# Altium schematic sheet LT8316.SchDoc: LT8316 Respin
size A4; Author: Alfonso Faria Espinoza; CompanyName: Waterloop; DrawnBy: Alfonso; Organization: Waterloop; Address1: Engineering 5; DocumentNumber: 1; Revision: 1; SheetNumber: 1; SheetTotal: 1
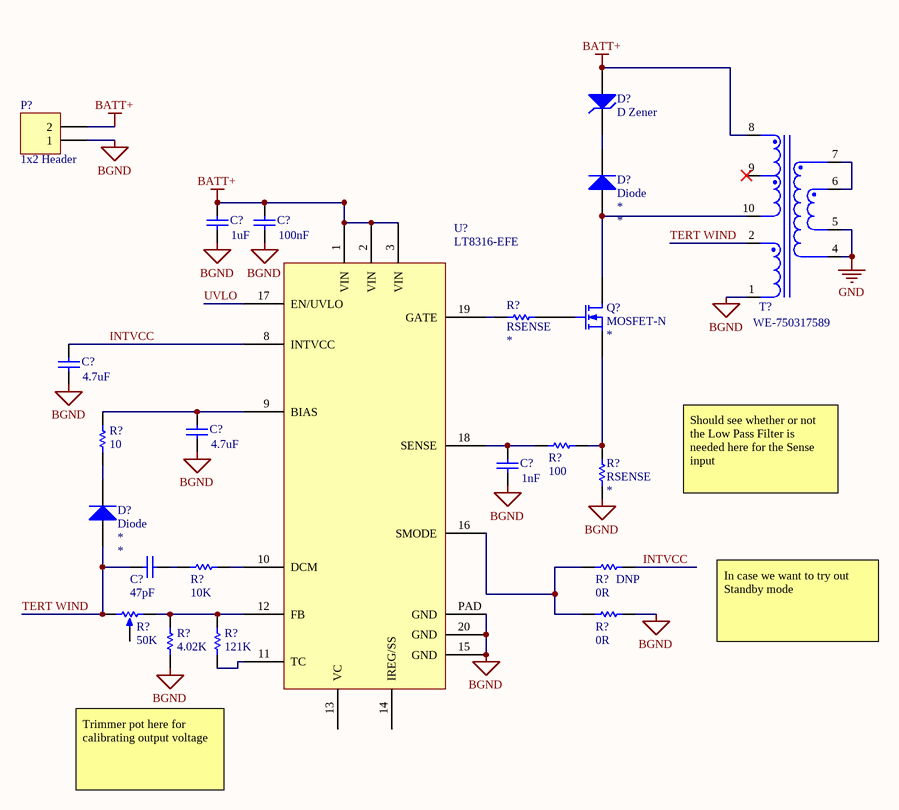
[diagram p0: LT8316.SchDoc]

## Parts
(Parts that share a designator on the sheet are numbered #1, #2 ... from top to bottom, then left to right.)
C?#1  value 1uF  (hidden comment: Capacitor - Nonpolarized)
C?#2  value 100nF  (hidden comment: Capacitor - Nonpolarized)
C?#3  value 4.7uF  (hidden comment: Capacitor - Nonpolarized)
C?#4  value 4.7uF  (hidden comment: Capacitor - Nonpolarized)
C?#5  value 1nF  (hidden comment: Capacitor - Nonpolarized)
C?#6  value 47pF  (hidden comment: Capacitor - Nonpolarized)
D?#1  D Zener  [DIODE-0.7]
D?#2  Diode
D?#3  Diode
P?  1x2 Header
Q?  MOSFET-N
R?#1  RSENSE  [0603 - Resistor]
R?#2  value 10  [0603 - Resistor]  (hidden comment: Resistor)
R?#3  value 100  [0603 - Resistor]  (hidden comment: RSENSE)
R?#4  RSENSE  [0603 - Resistor]
R?#5  value 10K  [0603 - Resistor]  (hidden comment: Resistor)
R?#6  DNP  value 0R  [0603 - Resistor]
R?#7  value 0R  [0603 - Resistor]  (hidden comment: Resistor)
R?#8  value 50K  (hidden comment: Resistor - Potentiometer)
R?#9  value 4.02K  [0603 - Resistor]  (hidden comment: Resistor)
R?#10  value 121K  [0603 - Resistor]  (hidden comment: Resistor)
T?  WE-750317589  [WE-750317589]
U?  LT8316-EFE  [LTC8315/8316]

## Nets
BATT+: C?#1.2 C?#2.2 D?#1.1(A) P?.2 T?.8 U?.1(VIN) U?.2(VIN) U?.3(VIN)
BGND: C?#1.1 C?#2.1 C?#3.1 C?#4.1 C?#5.1 P?.1 R?#4.1 R?#7.2 R?#9.1 T?.1 U?.15(GND) U?.20(GND) U?.PAD(GND)
GND: T?.4 T?.5
INTVCC: C?#3.2 R?#6.2 U?.8(INTVCC)
TERT WIND: C?#6.2 D?#3.1(A) R?#8.1(TOP) T?.2
UVLO: U?.17(EN/UVLO)
NetC?#4_2: C?#4.2 R?#2.2 U?.9(BIAS)
NetC?#5_2: C?#5.2 R?#3.2 U?.18(SENSE)
NetC?#6_1: C?#6.1 R?#5.1
NetD?#1_2: D?#1.2(K) D?#2.2(K)
NetD?#2_1: D?#2.1(A) Q?.1(D) T?.10
NetD?#3_2: D?#3.2(K) R?#2.1
NetQ?_2: Q?.2(G) R?#1.1
NetQ?_3: Q?.3(S) R?#3.1 R?#4.2
NetR?#1_2: R?#1.2 U?.19(GATE)
NetR?#5_2: R?#5.2 U?.10(DCM)
NetR?#6_1: R?#6.1 R?#7.1 U?.16(SMODE)
NetR?#8_2: R?#8.2(BOT) R?#9.2 R?#10.2 U?.12(FB)
NetR?#10_1: R?#10.1 U?.11(TC)
NetT?_6: T?.6 T?.7

Not connected (* = marked no-connect by the designer): R?#8 3(TAP); T? 9*; U? 13(VC) 14(IREG/SS)

## Notes on the sheet
- Should see whether or not the Low Pass Filter is needed here for the Sense input
- In case we want to try out Standby mode
- Trimmer pot here for calibrating output voltage
- Title:
- Size:
- Date:
- A4
- Author:
- Revision:
- Sheet
- of
- File:

## Library data of the parts
C?#1-C?#6 = Capacitor - Nonpolarized: Nonpolarized Capacitor; Supplier Part Number: *; Supplier: *; Manufacturer: *; Rating: *; Manufacturer Part Number: *
D?#1 = D Zener: Zener Diode; Published: 8-Jun-2000; LatestRevisionDate: 17-Jul-2002; LatestRevisionNote: Re-released for DXP Platform.; PackageReference: DIODE-0.7; Publisher: Altium Limited; PackageDescription: Diode, Thru-Hole; 2 Leads; 0.7 in Pin Spacing
P? = 1x2 Header: 1x2 Pin Header
Q? = MOSFET-N: N-Channel MOSFET; Supplier: *; Manufacturer Part Number: *; Supplier Part Number: *; Rating: *; Manufacturer: *; Value: *
R?#1 R?#3 R?#4 R?#6 = Resistor: Rating: *; Manufacturer Part Number: *; Manufacturer: *; Supplier Part Number: *; Supplier: *
  R?#1 R?#4: Value: *
R?#8 = Resistor - Potentiometer: Potentiometer; Manufacturer: *; Manufacturer Part Number: *; Supplier Part Number: *; Rating: *; Supplier: *
T? = WE-750317589: 100-600V Flyback Transformer; 7TH PART FIELD: TRANS.,; 5TH PART FIELD: P0926; 4TH PART FIELD: PULSE,
U? = LT8316-EFE: 600VIN MICROPOWER, ISOLATED NO-O
D?#2 D?#3 = Diode: Rating: *; Supplier Part Number: *; Manufacturer: *; Supplier: *; Value: *; Manufacturer Part Number: *
R?#2 R?#5 R?#7 R?#9 R?#10 = Resistor: Rating: *; Manufacturer Part Number: *; Manufacturer: *; Supplier Part Number: *; Supplier: *